# Altium schematic sheet CtDSP_IO.SchDoc
size 431 x 279 mm; SheetNumber: 1; SheetTotal: 2; ENG_APP_DATE: --/--/--; DSN_APP_DATE: --/--/--; CHK_APP_DATE: --/--/--
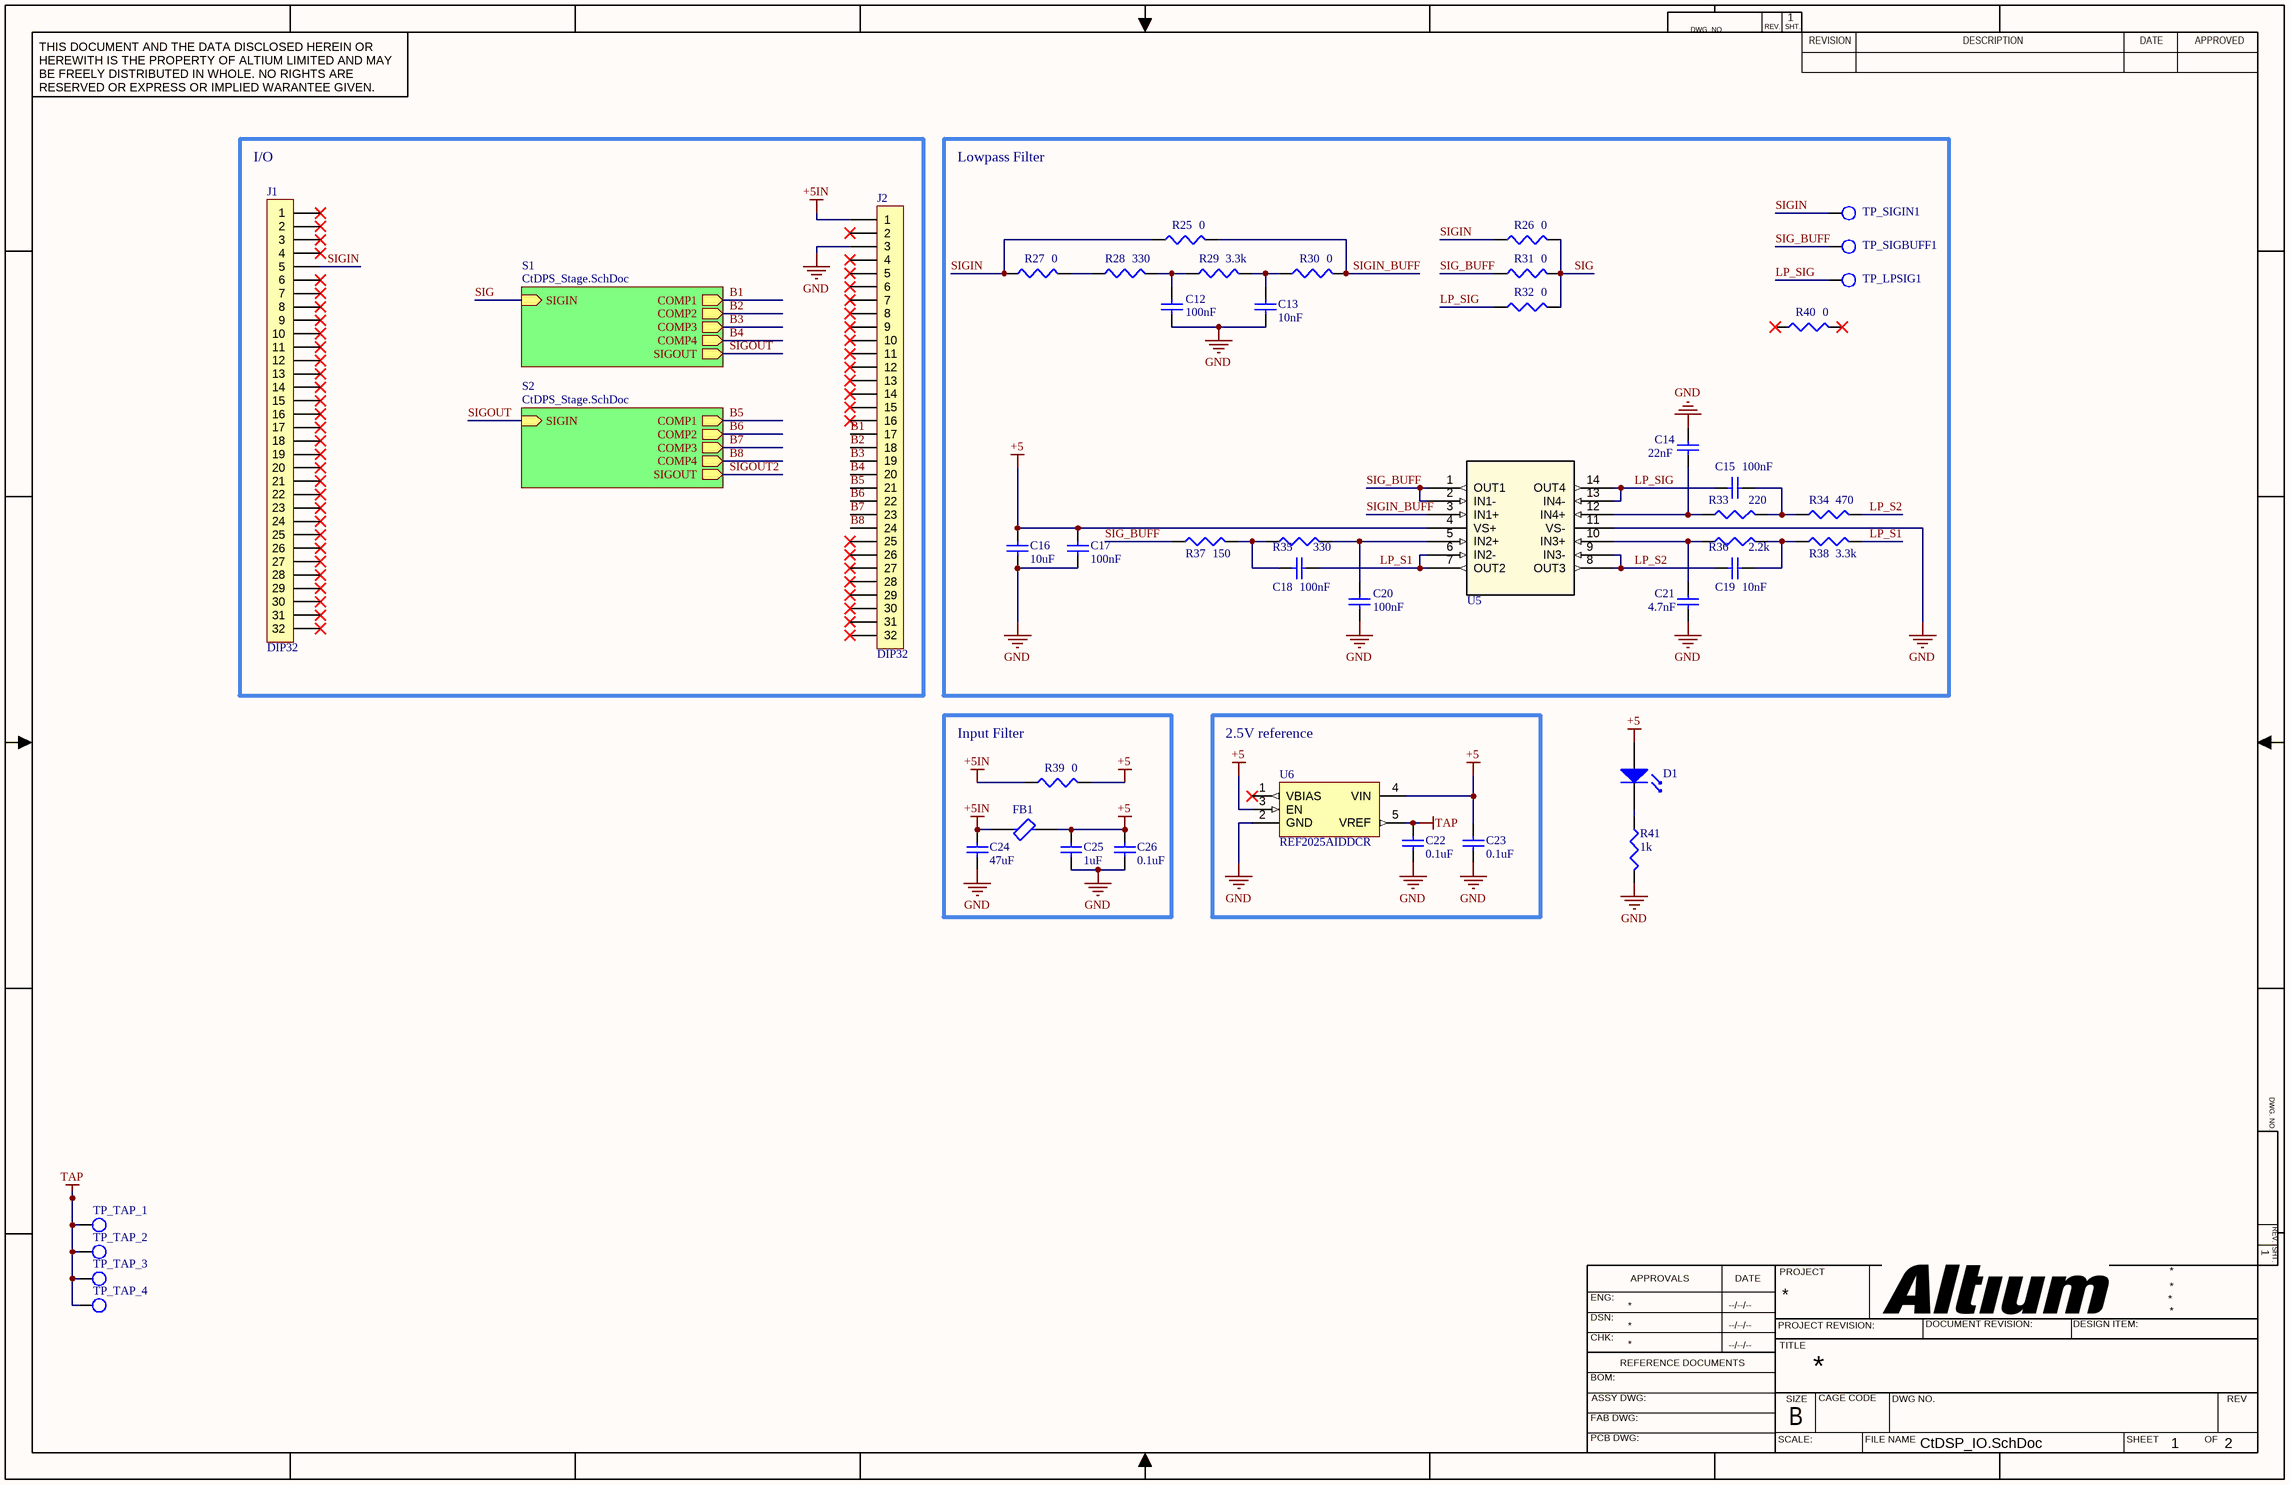
[diagram p0: CtDSP_IO.SchDoc]

## Parts
C12  100nF  [C_0402]
C13  10nF  [C_0402]
C14  22nF  [C_0402]
C15  100nF  [C_0402]
C16  10uF  [C_0402]
C17  100nF  [C_0402]
C18  100nF  [C_0402]
C19  10nF  [C_0402]
C20  100nF  [C_0402]
C21  4.7nF  [C_0402]
C22  0.1uF  [C_0402]
C23  0.1uF  [C_0402]
C24  47uF  [C_0805]
C25  1uF  [C_0603]
C26  0.1uF  [C_0402]
D1  LED_0603  [LED_6003]  (value not drawn)
FB1  BLM18PG121SN1D  [BLM18PG121SN1D]  (value not drawn)
J1  DIP32  [DIP32]
J2  DIP32  [DIP32]
R25  0  [RES_1206]
R26  0  [RES_1206]
R27  0  [RES_1206]
R28  330  [RES_0603]
R29  3.3k  [RES_0603]
R30  0  [RES_1206]
R31  0  [RES_1206]
R32  0  [RES_1206]
R33  220  [RES_0402]
R34  470  [RES_0402]
R35  330  [RES_0603]
R36  2.2k  [RES_0603]
R37  150  [RES_0603]
R38  3.3k  [RES_0603]
R39  0  [RES_1206]
R40  0  [RES_1206]
R41  1k  [RES_0402]
TP_LPSIG1  TESTPOINT  [TESTPOINT]  (value not drawn)
TP_SIGBUFF1  TESTPOINT  [TESTPOINT]  (value not drawn)
TP_SIGIN1  TESTPOINT  [TESTPOINT]  (value not drawn)
TP_TAP_1  TESTPOINT  [TESTPOINT]  (value not drawn)
TP_TAP_2  TESTPOINT  [TESTPOINT]  (value not drawn)
TP_TAP_3  TESTPOINT  [TESTPOINT]  (value not drawn)
TP_TAP_4  TP_TAP_4  [TESTPOINT]  (value not drawn)
U5  ADA4891-4ARZ-R7  [ADA4891-4ARZ-R7]  (value not drawn)
U6  REF2025AIDDCR  [REF2025AIDDCR]

## Blocks framed on the sheet
I/O: J1 J2
Lowpass Filter: C12-C21 R25-R38 R40 TP_LPSIG1 TP_SIGBUFF1 TP_SIGIN1 U5
Input Filter: C24-C26 FB1 R39
2.5V reference: C22 C23 U6

## Sub-sheets
S1 = CtDPS_Stage.SchDoc: SIGIN (in), COMP1 (out), COMP2 (out), COMP3 (out), COMP4 (out), SIGOUT (out)
S2 = CtDPS_Stage.SchDoc: SIGIN (in), COMP1 (out), COMP2 (out), COMP3 (out), COMP4 (out), SIGOUT (out)

## Nets
+5: C16.1 C17.2 C23.1 C25.2 C26.1 D1.2(K) FB1.2 R39.2 U5.4(VS+) U6.3(EN) U6.4(VIN)
+5IN: C24.2 FB1.1 J2.1 R39.1
GND: C12.1 C13.1 C14.2 C16.2 C17.1 C20.1 C21.1 C22.2 C23.2 C24.1 C25.1 C26.2 J2.3 R41.2 U5.11(VS-) U6.2(GND)
TAP: C22.1 TP_TAP_1.1 TP_TAP_2.1 TP_TAP_3.1 TP_TAP_4.1 U6.5(VREF)
B1: J2.17 ; sheet S1/COMP1
B2: J2.18 ; sheet S1/COMP2
B3: J2.19 ; sheet S1/COMP3
B4: J2.20 ; sheet S1/COMP4
B5: J2.21 ; sheet S2/COMP1
B6: J2.22 ; sheet S2/COMP2
B7: J2.23 ; sheet S2/COMP3
B8: J2.24 ; sheet S2/COMP4
LP_S1: C18.1 R38.2 U5.6(IN2-) U5.7(OUT2)
LP_S2: C19.1 R34.2 U5.8(OUT3) U5.9(IN3-)
LP_SIG: C15.2 R32.1 TP_LPSIG1.1 U5.13(IN4-) U5.14(OUT4)
SIG: R26.2 R31.2 R32.2 ; sheet S1/SIGIN
SIG_BUFF: R31.1 R37.1 TP_SIGBUFF1.1 U5.1(OUT1) U5.2(IN1-)
SIGIN: J1.5 R25.1 R26.1 R27.1 TP_SIGIN1.1
SIGIN_BUFF: R25.2 R30.2 U5.3(IN1+)
SIGOUT: sheet S1/SIGOUT, sheet S2/SIGIN
SIGOUT2: sheet S2/SIGOUT
NetC12_2: C12.2 R28.2 R29.1
NetC13_2: C13.2 R29.2 R30.1
NetC14_1: C14.1 R33.1 U5.12(IN4+)
NetC15_1: C15.1 R33.2 R34.1
NetC18_2: C18.2 R35.1 R37.2
NetC19_2: C19.2 R36.2 R38.1
NetC20_2: C20.2 R35.2 U5.5(IN2+)
NetC21_2: C21.2 R36.1 U5.10(IN3+)
NetD1_1: D1.1(A) R41.1
NetR27_2: R27.2 R28.1

Not connected (* = marked no-connect by the designer): J1 1* 2* 3* 4* 6* 7* 8* 9* 10* 11* 12* 13* 14* 15* 16* 17* 18* 19* 20* 21* 22* 23* 24* 25* 26* 27* 28* 29* 30* 31* 32*; J2 2* 4* 5* 6* 7* 8* 9* 10* 11* 12* 13* 14* 15* 16* 25* 26* 27* 28* 29* 30* 31* 32*; R40 1* 2*; U6 1(VBIAS)*

## Notes on the sheet
- DWG. NO.
- REV.
- SHT.
- THIS DOCUMENT AND THE DATA DISCLOSED HEREIN OR HEREWITH IS THE PROPERTY OF ALTIUM LIMITED AND MAY BE FREELY DISTRIBUTED IN WHOLE. NO RIGHTS ARE RESERVED OR EXPRESS OR IMPLIED WARANTEE GIVEN.
- REVISION
- DESCRIPTION
- DATE
- APPROVED
- ENG:
- APPROVALS
- PROJECT
- DSN:
- CHK:
- REFERENCE DOCUMENTS
- PROJECT REVISION:
- TITLE
- DOCUMENT REVISION:
- DESIGN ITEM:
- BOM:
- FAB DWG:
- PCB DWG:
- ASSY DWG:
- SCALE:
- SIZE
- B
- CAGE CODE
- FILE NAME
- DWG NO.
- SHEET
- OF
- REV

## Library data of the parts
C12-C23 C26 = C_0402
  C12 C15 C17 C18 C20 C22 C23 C26: LCSC Part #: C1525
  C13 C19: LCSC Part #: C15195
  C14: LCSC Part #: C1532
  C16: LCSC Part #: C15525
  C21: LCSC Part #: C1538
C24 = C_0805: LCSC Part #: C16780
C25 = C_0603: LCSC Part #: C15849
FB1 = BLM18PG121SN1D: -55℃~+125℃ 1 120Ω@100MHz 2A 50mΩ ±25% 0603 Ferrite Beads ROHS; LCSC Part #: C14709
R25-R27 R30-R32 R39 R40 = RES_1206: LCSC Part #: C17888
R28 R29 R35-R38 = RES_0603
  R28 R35: LCSC Part #: C23138
  R29 R38: LCSC Part #: C22978
  R36: LCSC Part #: C4190
  R37: LCSC Part #: C22808
R33 R34 R41 = RES_0402
  R33: LCSC Part #: C25091
  R34: LCSC Part #: C25117
  R41: LCSC Part #: C11702
TP_TAP_4 = TESTPOINT
U5 = ADA4891-4ARZ-R7: Quad Rail-to-Rail Op-Amp, 240 MHz, 170 V/µs, SOT-23-5; LCSC Part #: C654290
D1 = LED_0603: LCSC Part #: C2286
U6 = REF2025AIDDCR: LCSC Part #: C962078